# EasyEDA Pro project ProDoc_P1_2026-04-07.epro

# Schematic Schematic1
Create Date: 2026-04-06; Page Name: P1; Project Name: VL53L0X_1; Schematic Name: Schematic1; Update Date: 2026-04-06; Company: EasyEDA.com; Page Size: A4; Version: V1.0
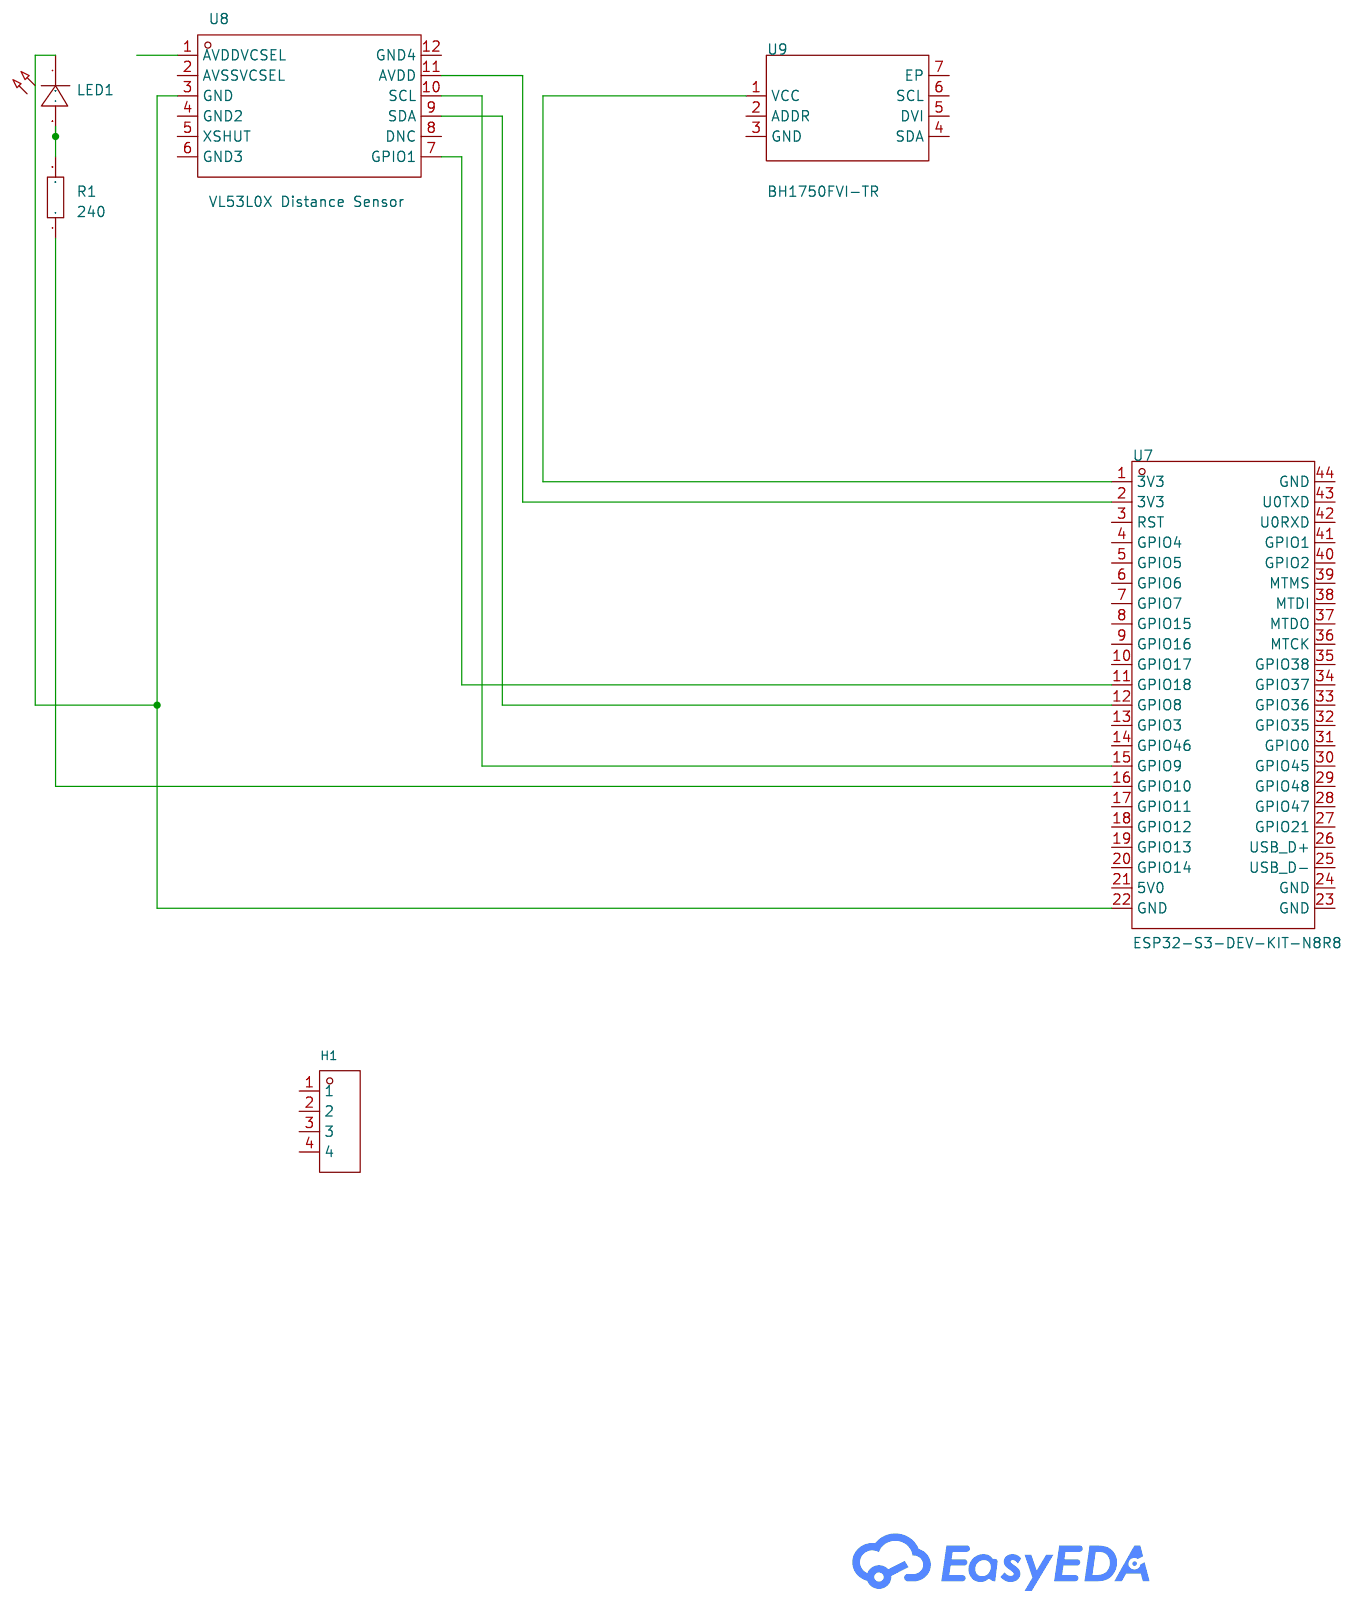
[diagram p0: schematic sheet]

## Parts
H1  -  [HDR-TH_4P-P2.54-V-F]
LED1  -  [LED0603-RD_GREEN]
R1  10K  [R0603]
U7  ESP32-S3-DEV-KIT-N8R8  [COMM-TH_L63.3-W25.4-P2.54-LS22.86]
U8  VL53L0X Distance Sensor  [SENSOR-SMD_12P-L4.4-W2.4_VL53L0X]
U9  BH1750FVI-TR  [WSOF-6_L2.6-W1.6-P0.50-TL-EP]

## Library data of the parts
H1 = HDR-F_2.54_1x4P: Supplier Footprint: Through
LED1 = LED_0603-G
R1 = Res_0603: Supplier Footprint: 0603
U7 = ESP32-S3-DEV-KIT-N8R8: Supplier Part: C9900170771; Supplier Footprint: SMD; Supplier: LCSC
U8 = VL53L0X Distance Sensor: LCSC Part Name: 飞行时间 测距传感器模块 2米 I2C接口; Supplier Part: C431944; Manufacturer: Waveshare(微雪电子); JLCPCB Part Class: Extended Part; Datasheet: https://atta.szlcsc.com/upload/public/pdf/source/20190925/C431944_760C760E5F8991C87349673069DEAF55.pdf; Supplier: LCSC
U9 = BH1750FVI-TR: Measurement Type:Light Intensity Photoperceptivity:65.535klx Detection color:- Interface:I2C Voltage - Supply:2.4V~3.6V Voltage - Supply:2.4V~3.6V Quiescent Current:- Operating Temperature:-40℃~+85℃ Operating Temperature:-40℃~+85℃; Supplier Part: C78960; Manufacturer: ROHM(罗姆); Supplier Footprint: WSOF-6; JLCPCB Part Class: Extended Part; Datasheet: https://item.szlcsc.com/datasheet/BH1750FVI-TR/80097.html; Supplier: LCSC; Measurement Type: Light Intensity; Photoperceptivity: 65.535klx; Interface: I2C; Voltage - Supply: 2.4V~3.6V; Operating Temperature: -40℃~+85℃

## Nets
Net-(LED1-1): LED1.1(C) U7.22(GND) U8.3(GND)
Net-(LED1-2): LED1.2(A) R1.2
Net-(R1-1): R1.1 U7.16(GPIO10)
Net-(U7-1): U7.1(3V3) U9.1(VCC)
Net-(U7-2): U7.2(3V3) U8.11(AVDD)
Net-(U7-11): U7.11(GPIO18) U8.7(GPIO1)
Net-(U7-12): U7.12(GPIO8) U8.9(SDA)
Net-(U7-15): U7.15(GPIO9) U8.10(SCL)

Not connected (* = marked no-connect by the designer): H1 1 2 3 4; U7 3(RST) 4(GPIO4) 5(GPIO5) 6(GPIO6) 7(GPIO7) 8(GPIO15) 9(GPIO16) 10(GPIO17) 13(GPIO3) 14(GPIO46) 17(GPIO11) 18(GPIO12) 19(GPIO13) 20(GPIO14) 21(5V0) 23(GND) 24(GND) 25(USB_D-) 26(USB_D+) 27(GPIO21) 28(GPIO47) 29(GPIO48) 30(GPIO45) 31(GPIO0) 32(GPIO35) 33(GPIO36) 34(GPIO37) 35(GPIO38) 36(MTCK) 37(MTDO) 38(MTDI) 39(MTMS) 40(GPIO2) 41(GPIO1) 42(U0RXD) 43(U0TXD) 44(GND); U8 1(AVDDVCSEL) 2(AVSSVCSEL) 4(GND2) 5(XSHUT) 6(GND3) 8(DNC) 12(GND4); U9 2(ADDR) 3(GND) 4(SDA) 5(DVI) 6(SCL) 7(EP)
